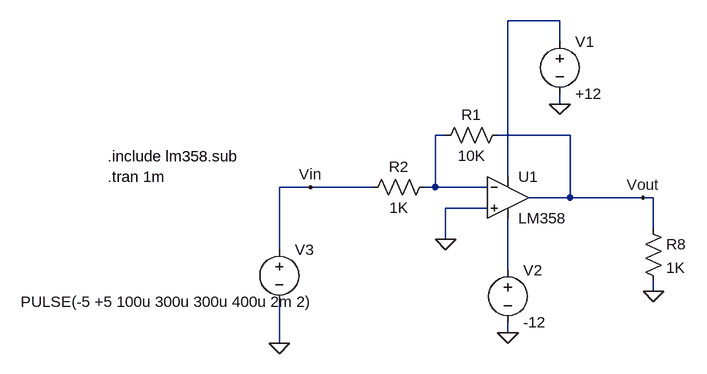
[diagram p0: schematic Opamp Model.asc]
Opamp Model.asc, the LTspice schematic file:
Version 4
SHEET 1 2716 3076
WIRE 48 1728 -32 1728
WIRE 48 1760 48 1728
WIRE 48 1856 48 1840
WIRE -128 1904 -144 1904
WIRE 64 1904 -48 1904
WIRE -32 1968 -32 1728
WIRE -336 1984 -384 1984
WIRE -240 1984 -336 1984
WIRE -144 1984 -144 1904
WIRE -144 1984 -160 1984
WIRE -64 1984 -144 1984
WIRE 64 2000 64 1904
WIRE 64 2000 0 2000
WIRE 176 2000 64 2000
WIRE 192 2000 176 2000
WIRE -64 2016 -128 2016
WIRE 192 2048 192 2000
WIRE -128 2064 -128 2016
WIRE -384 2080 -384 1984
WIRE -32 2112 -32 2032
WIRE 192 2144 192 2128
WIRE -32 2208 -32 2192
WIRE -384 2224 -384 2160
FLAG 48 1856 0
FLAG -384 2224 0
FLAG -336 1984 Vin
FLAG 192 2144 0
FLAG 176 2000 Vout
FLAG -32 2208 0
FLAG -128 2064 0
SYMBOL res 176 2032 R0
SYMATTR InstName R8
SYMATTR Value 1K
SYMBOL voltage 48 1744 R0
WINDOW 123 0 0 Left 2
WINDOW 39 0 0 Left 2
SYMATTR InstName V1
SYMATTR Value +12
SYMBOL voltage -32 2096 R0
WINDOW 123 0 0 Left 2
WINDOW 39 0 0 Left 2
SYMATTR InstName V2
SYMATTR Value -12
SYMBOL res -32 1888 R90
WINDOW 0 0 56 VBottom 2
WINDOW 3 32 56 VTop 2
SYMATTR InstName R1
SYMATTR Value 10K
SYMBOL res -144 1968 R90
WINDOW 0 0 56 VBottom 2
WINDOW 3 32 56 VTop 2
SYMATTR InstName R2
SYMATTR Value 1K
SYMBOL Opamps\\opamp2 -32 1936 R0
SYMATTR InstName U1
SYMATTR Value LM358
SYMBOL voltage -384 2064 R0
WINDOW 3 -398 96 Left 2
WINDOW 123 0 0 Left 2
WINDOW 39 0 0 Left 2
SYMATTR InstName V3
SYMATTR Value PULSE(-5 +5 100u 300u 300u 400u 2m 2)
TEXT -648 1968 Left 2 !.tran 1m
TEXT -648 1936 Left 2 !.include lm358.sub

The netlist it stands for:
* Opamp Model.asc
R8 Vout 0 1K
V1 N001 0 +12
V2 N003 0 -12
R1 Vout N002 10K
R2 N002 Vin 1K
XU1 0 N002 N001 N003 Vout LM358  ; pins In+ In- V+ V- OUT
V3 Vin 0 PULSE(-5 +5 100u 300u 300u 400u 2m 2)
.tran 1m
.include lm358.sub
.backanno
.end